# EAGLE schematic control (EAGLE 9.6.2)
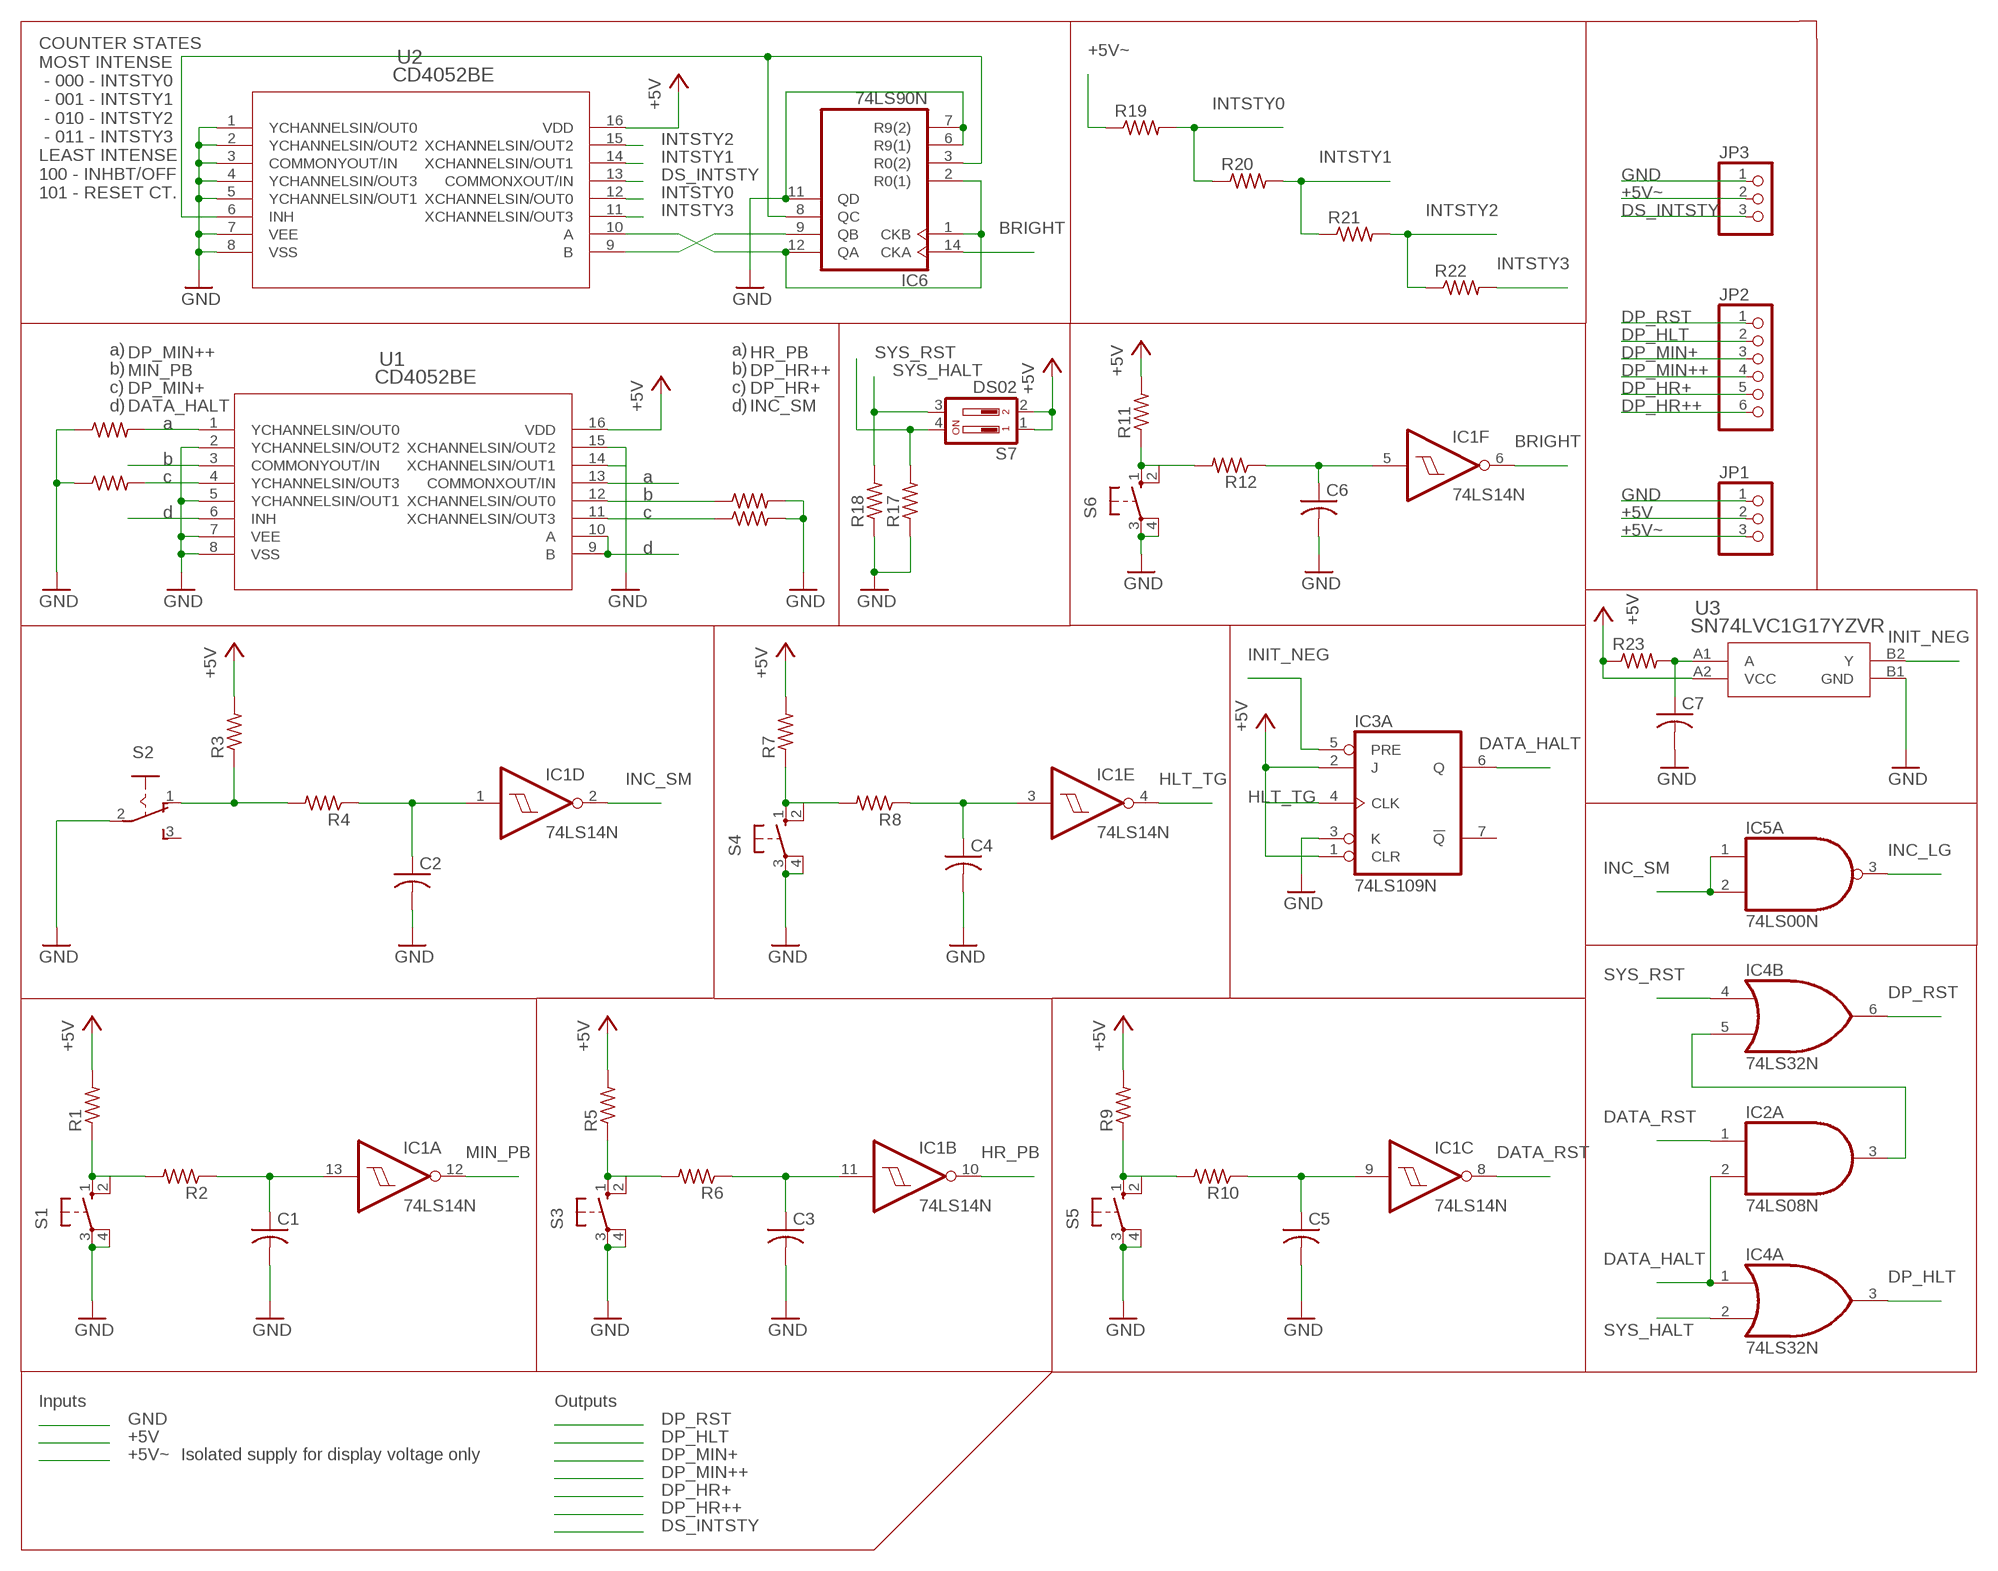
[diagram p0: schematic, sheet 1]

## Parts
C1  C-US025-024X044  [C025-024X044]
C2  C-US025-024X044  [C025-024X044]
C3  C-US025-024X044  [C025-024X044]
C4  C-US025-024X044  [C025-024X044]
C5  C-US025-024X044  [C025-024X044]
C6  C-US025-024X044  [C025-024X044]
C7  C-US025-025X050  [C025-025X050]
IC1  74LS14N  [DIL14]
IC2  74LS08N  [DIL14]
IC3  74LS109N  [DIL16]
IC4  74LS32N  [DIL14]
IC5  74LS00N  [DIL14]
IC6  74LS90N  [DIL14]
JP1  PINHD-1X3  [1X03]
JP2  PINHD-1X6  [1X06]
JP3  PINHD-1X3  [1X03]
R1  R-US_0204/7  [0204/7]
R2  R-US_0204/7  [0204/7]
R3  R-US_0204/7  [0204/7]
R4  R-US_0204/7  [0204/7]
R5  R-US_0204/7  [0204/7]
R6  R-US_0204/7  [0204/7]
R7  R-US_0204/7  [0204/7]
R8  R-US_0204/7  [0204/7]
R9  R-US_0204/7  [0204/7]
R10  R-US_0204/7  [0204/7]
R11  R-US_0204/7  [0204/7]
R12  R-US_0204/7  [0204/7]
R13  R-US_0204/7  [0204/7]
R14  R-US_0204/7  [0204/7]
R15  R-US_0204/7  [0204/7]
R16  R-US_0204/7  [0204/7]
R17  R-US_0204/7  [0204/7]
R18  R-US_0204/7  [0204/7]
R19  R-US_0204/7  [0204/7]
R20  R-US_0204/7  [0204/7]
R21  R-US_0204/7  [0204/7]
R22  R-US_0204/7  [0204/7]
R23  R-US_0204/7  [0204/7]
S1  10-XX  [B3F-10XX]
S2  255SB  [255SB]
S3  10-XX  [B3F-10XX]
S4  10-XX  [B3F-10XX]
S5  10-XX  [B3F-10XX]
S6  10-XX  [B3F-10XX]
S7  DS02  [DS-02]
U1  CD4052BE  [N16]
U2  CD4052BE  [N16]
U3  SN74LVC1G17YZVR  [YZV4]

## Nets
+5V: IC3.1(A:CLR) IC3.2(A:J) JP1.2 R1.2 R3.2 R5.2 R7.2 R9.2 R11.2 R23.1 S7.1 S7.2 U1.16(VDD) U2.16(VDD) U3.A2(VCC)
+5V~: JP1.3 JP3.2 R19.1
BRIGHT: IC1.6(F:O) IC6.14(CKA)
DATA_HALT: IC2.2(A:I1) IC3.6(A:Q) IC4.1(A:I0) U1.6(INH)
DATA_RST: IC1.8(C:O) IC2.1(A:I0)
DP_HLT: IC4.3(A:O) JP2.2
DP_HR+: JP2.5 R16.1 U1.11(XCHANNELSIN/OUT3)
DP_HR++: JP2.6 R15.1 U1.12(XCHANNELSIN/OUT0)
DP_MIN+: JP2.3 R14.2 U1.4(YCHANNELSIN/OUT3)
DP_MIN++: JP2.4 R13.2 U1.1(YCHANNELSIN/OUT0)
DP_RST: IC4.6(B:O) JP2.1
DS_INTSTY: JP3.3 U2.13(COMMONXOUT/IN)
GND: C1.2 C2.2 C3.2 C4.2 C5.2 C6.2 C7.2 IC3.3(A:K) IC6.6(R9(1)) IC6.7(R9(2)) IC6.11(QD) JP1.1 JP3.1 R13.1 R14.1 R15.2 R16.2 R17.1 R18.1 S1.3(P) S1.4(P1) S2.2(P) S3.3(P) S3.4(P1) S4.3(P) S4.4(P1) S5.3(P) S5.4(P1) S6.3(P) S6.4(P1) U1.2(YCHANNELSIN/OUT2) U1.5(YCHANNELSIN/OUT1) U1.7(VEE) U1.8(VSS) U1.15(XCHANNELSIN/OUT2) U2.1(YCHANNELSIN/OUT0) U2.2(YCHANNELSIN/OUT2) U2.3(COMMONYOUT/IN) U2.4(YCHANNELSIN/OUT3) U2.5(YCHANNELSIN/OUT1) U2.7(VEE) U2.8(VSS) U3.B1(GND)
HLT_TG: IC1.4(E:O) IC3.4(A:CLK)
HR_PB: IC1.10(B:O) U1.13(COMMONXOUT/IN)
INC_LG: IC5.3(A:O)
INC_SM: IC1.2(D:O) IC5.1(A:I0) IC5.2(A:I1) U1.9(B) U1.10(A)
INIT_NEG: IC3.5(A:PRE) U3.B2(Y)
INTSTY0: R19.2 R20.1 U2.12(XCHANNELSIN/OUT0)
INTSTY1: R20.2 R21.1 U2.14(XCHANNELSIN/OUT1)
INTSTY2: R21.2 R22.1 U2.15(XCHANNELSIN/OUT2)
INTSTY3: R22.2 U2.11(XCHANNELSIN/OUT3)
MIN_PB: IC1.12(A:O) U1.3(COMMONYOUT/IN)
N$1: R1.1 R2.2 S1.1(S) S1.2(S1)
N$2: C1.1 IC1.13(A:I) R2.1
N$3: R5.1 R6.2 S3.1(S) S3.2(S1)
N$4: C3.1 IC1.11(B:I) R6.1
N$5: R3.1 R4.2 S2.1(O)
N$6: C2.1 IC1.1(D:I) R4.1
N$7: R11.1 R12.2 S6.1(S) S6.2(S1)
N$8: C6.1 IC1.5(F:I) R12.1
N$9: R9.1 R10.2 S5.1(S) S5.2(S1)
N$10: IC2.3(A:O) IC4.5(B:I1)
N$11: C5.1 IC1.9(C:I) R10.1
N$12: R7.1 R8.2 S4.1(S) S4.2(S1)
N$13: C4.1 IC1.3(E:I) R8.1
N$14: IC6.3(R0(2)) IC6.8(QC) U2.6(INH)
N$15: C7.1 R23.2 U3.A1(A)
N$16: U1.14(XCHANNELSIN/OUT1)
N$17: IC6.9(QB) U2.9(B)
N$18: IC6.1(CKB) IC6.2(R0(1)) IC6.12(QA) U2.10(A)
SYS_HALT: IC4.2(A:I1) R18.2 S7.3
SYS_RST: IC4.4(B:I0) R17.2 S7.4
Unconnected: IC2.4(B:I0) IC2.5(B:I1) IC2.6(B:O) IC2.8(C:O) IC2.9(C:I0) IC2.10(C:I1) IC2.11(D:O) IC2.12(D:I0) IC2.13(D:I1) IC3.7(A:!Q) IC3.9(B:!Q) IC3.10(B:Q) IC3.11(B:PRE) IC3.12(B:CLK) IC3.13(B:K) IC3.14(B:J) IC3.15(B:CLR) IC4.8(C:O) IC4.9(C:I0) IC4.10(C:I1) IC4.11(D:O) IC4.12(D:I0) IC4.13(D:I1) IC5.4(B:I0) IC5.5(B:I1) IC5.6(B:O) IC5.8(C:O) IC5.9(C:I0) IC5.10(C:I1) IC5.11(D:O) IC5.12(D:I0) IC5.13(D:I1) S2.3(S)

## Notes on the sheet
- COUNTER STATES
  MOST INTENSE
   - 000 - INTSTY0 
   - 001 - INTSTY1
   - 010 - INTSTY2
   - 011 - INTSTY3
  LEAST INTENSE
  100 - INHBT/OFF
  101 - RESET CT.
- a)
  b)
  c)
  d)
- a)
  b)
  c)
  d)
- a
- b
- c | a
- b
- d | c
- d
- Inputs | Outputs
- Isolated supply for display voltage only

## Power pins joined to a net without a drawn wire
GND: IC1.7(P:GND) IC2.7(P:GND) IC3.8(P:GND) IC4.7(P:GND) IC5.7(P:GND) IC6.10(GND)
VCC: IC1.14(P:VCC) IC2.14(P:VCC) IC3.16(P:VCC) IC4.14(P:VCC) IC5.14(P:VCC) IC6.5(VCC)

## Library data of the parts
C1-C7 = rcl:C-US: CAPACITOR, American symbol; SPICEPREFIX: C
IC1 = 74xx-us:74*14: Hex schmitt trigger INVERTER
IC2 = 74xx-us:74*08: Quad 2-input AND gate
IC3 = 74xx-us:74*109: Dual J-K positive edge triggered FLIP FLOP, preset and clear
IC4 = 74xx-us:74*32: Quad 2-input OR gate
IC5 = 74xx-us:74*00: Quad 2-input NAND gate
IC6 = 74xx-us:74*90: Decade, divide by twelve and binary COUNTER
JP1 JP3 = pinhead:PINHD-1X3: PIN HEADER
JP2 = pinhead:PINHD-1X6: PIN HEADER
R1-R23 = rcl:R-US_: RESISTOR, American symbol; SPICEPREFIX: R
S1 S3-S6 = switch-omron:10-XX: OMRON SWITCH; MPN: B3F-1000; OC_FARNELL: 176432; OC_NEWARK: 36M3542
S2 = switch:255SB: SLIDING SWITCH Distributor Buerklin, 11G810
S7 = Switch:DS02: DIL/CODE SWITCH; CATEGORY: SWITCH; MPN: MCNDS02; TYPE: SPST
U1 U2 = cd family:CD4052BE: 4:1 Dual-Channel General MUX; DATASHEET_URL: http://www.ti.com/lit/gpn/CD4052B; DESCRIPTION: CMOS Differential 4-Channel Analog Multiplexer/Demultiplexer with Logic-Level Conversion; FAMILY_NAME: ANALOG SWITCH/MULTIPLEXER (greater than 5V); GENERIC_PART_NUMBER: CD4052B; INDUSTRY_STD_PKG_TYPE: PDIP; MANUFACTURER: Texas Instruments; PACKAGE_DESIGNATOR: N; PIN_COUNT: 16
U3 = SN74LVC1G17YZVR:SN74LVC1G17YZVR; DATASHEET_URL: http://www.ti.com/lit/gpn/SN74LVC1G17; DESCRIPTION: Single Schmitt-Trigger Buffer; FAMILY_NAME: LL SCHMITT TRIGGER BUFFER; GENERIC_PART_NUMBER: SN74LVC1G17; INDUSTRY_STD_PKG_TYPE: DSBGA; MANUFACTURER: Texas Instruments; MANUFACTURER_PART_NUMBER: SN74LVC1G17YZVR; PACKAGE_DESIGNATOR: YZV; PIN_COUNT: 4; VENDOR: Texas Instruments

## Module V
Ports: 

### Library data of the parts